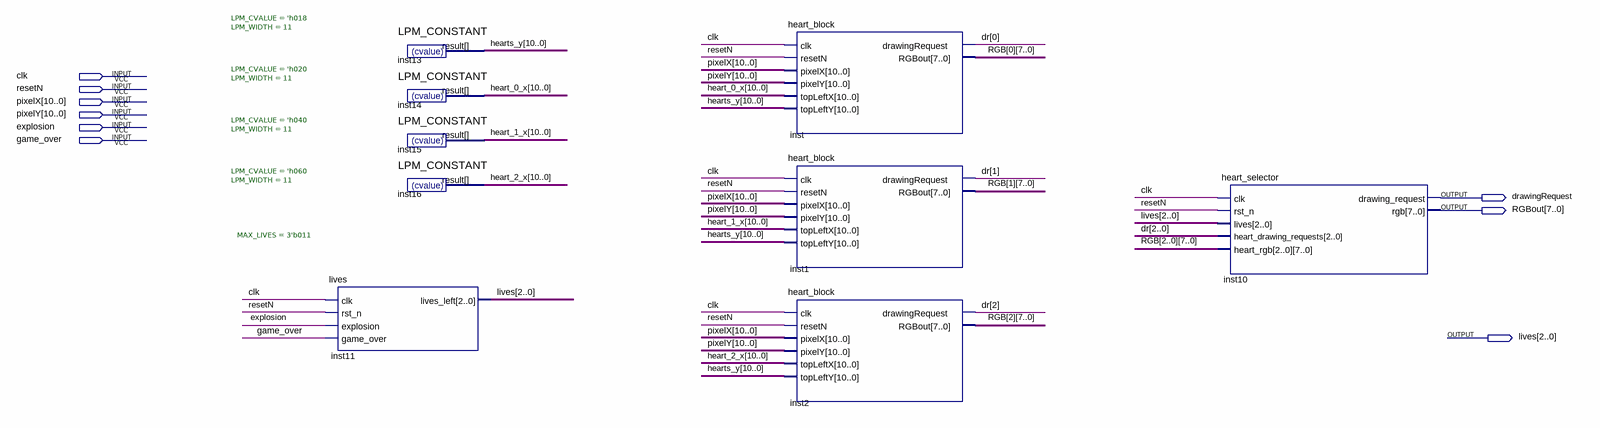
[diagram p0: schematic sheet]
// Quartus schematic heart_display.bdf as structural Verilog: 9 symbols, 9 pins
module heart_display (
  input  clk,
  input  resetN,
  input  [10:0] pixelX,
  input  [10:0] pixelY,
  input  explosion,
  input  game_over,
  output drawingRequest,
  output [7:0] RGBout,
  output [2:0] lives
);

  wire [2:0] dr;
  wire [7:0] RGB_0, RGB_1, RGB_2;
  wire [10:0] heart_0_x, heart_1_x, heart_2_x, hearts_y;

  lives #(.MAX_LIVES(3'b011)) inst11 (
    .clk(clk), .rst_n(resetN), .explosion(explosion), .game_over(game_over), .lives_left(lives));
  LPM_CONSTANT #(.LPM_CVALUE('h018), .LPM_WIDTH(11)) inst13 (.result(hearts_y));
  LPM_CONSTANT #(.LPM_CVALUE('h020), .LPM_WIDTH(11)) inst14 (.result(heart_0_x));
  LPM_CONSTANT #(.LPM_CVALUE('h040), .LPM_WIDTH(11)) inst15 (.result(heart_1_x));
  LPM_CONSTANT #(.LPM_CVALUE('h060), .LPM_WIDTH(11)) inst16 (.result(heart_2_x));
  heart_block inst (
    .clk(clk), .resetN(resetN), .pixelX(pixelX), .pixelY(pixelY), .topLeftX(heart_0_x), .topLeftY(hearts_y),
    .drawingRequest(dr[0]), .RGBout(RGB_0));
  heart_block inst1 (
    .clk(clk), .resetN(resetN), .pixelX(pixelX), .pixelY(pixelY), .topLeftX(heart_1_x), .topLeftY(hearts_y),
    .drawingRequest(dr[1]), .RGBout(RGB_1));
  heart_block inst2 (
    .clk(clk), .resetN(resetN), .pixelX(pixelX), .pixelY(pixelY), .topLeftX(heart_2_x), .topLeftY(hearts_y),
    .drawingRequest(dr[2]), .RGBout(RGB_2));
  heart_selector inst10 (
    .clk(clk), .rst_n(resetN), .lives(lives), .heart_drawing_requests(dr), .heart_rgb({RGB_2, RGB_1, RGB_0}),
    .drawing_request(drawingRequest), .rgb(RGBout));
endmodule
